# Altium schematic sheet Hub.SchDoc
size Letter; CompanyName: Ploopy Co; Organization: Ploopy Co; Address1: 137-1140 Burnhamthorpe Road W; Address2: Mississauga; Address3: Ontario; Address4: Canada L5C 0A3; DocumentNumber: 1; Revision: R1.001; SheetNumber: 1; SheetTotal: 7
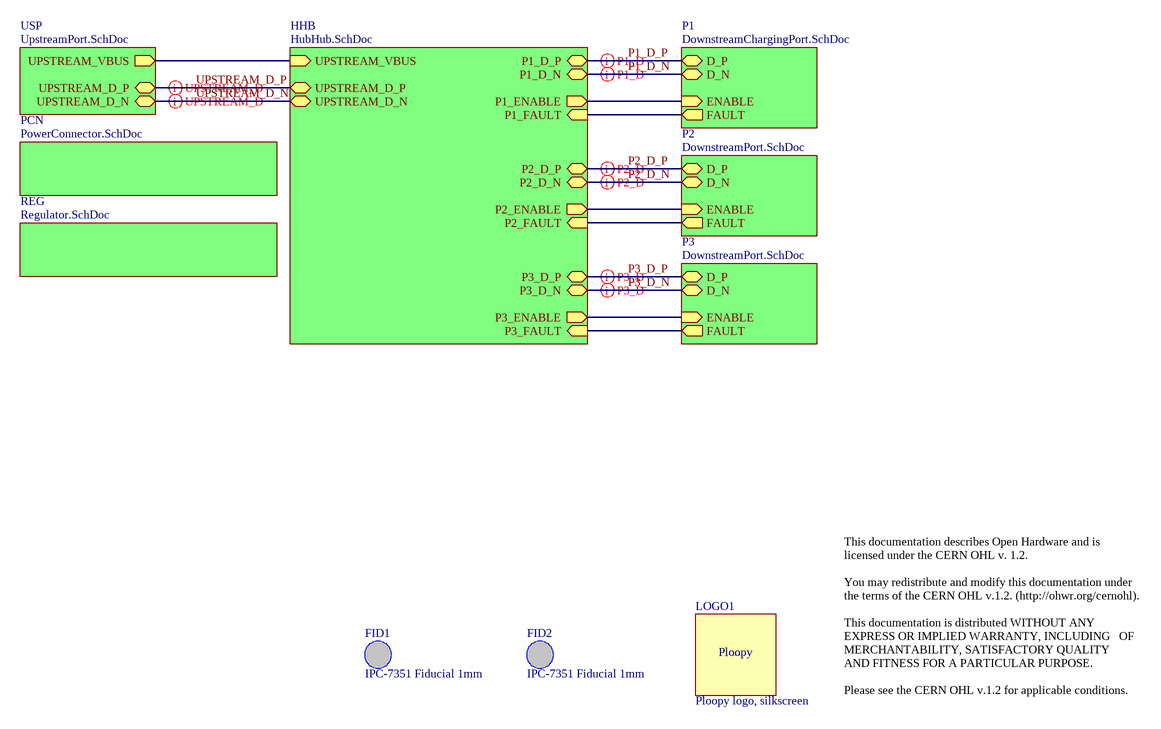
[diagram p0: Hub.SchDoc]

## Parts
FID1  IPC-7351 Fiducial 1mm  [FIDUCIAL_1.5]
FID2  IPC-7351 Fiducial 1mm  [FIDUCIAL_1.5]
LOGO1  Ploopy logo, silkscreen  [PloopyLogo]  (no BOM)

## Sub-sheets
HHB = HubHub.SchDoc: P1_ENABLE (out), P2_FAULT (in), P3_FAULT (in), P1_FAULT (in), UPSTREAM_VBUS (in), P3_ENABLE (out), P2_ENABLE (out), P3_D_P (bidir), UPSTREAM_D_P (bidir), P1_D_N (bidir), UPSTREAM_D_N (bidir), P2_D_P (bidir), P2_D_N (bidir), P1_D_P (bidir), P3_D_N (bidir)
P1 = DownstreamChargingPort.SchDoc: FAULT (out), ENABLE (in), D_N (bidir), D_P (bidir)
P2 = DownstreamPort.SchDoc: ENABLE (in), FAULT (out), D_N (bidir), D_P (bidir)
P3 = DownstreamPort.SchDoc: FAULT (out), ENABLE (in), D_N (bidir), D_P (bidir)
PCN = PowerConnector.SchDoc: no entries
REG = Regulator.SchDoc: no entries
USP = UpstreamPort.SchDoc: UPSTREAM_VBUS (out), UPSTREAM_D_N (bidir), UPSTREAM_D_P (bidir)

## Nets
P1_D_N: sheet P1/D_N, sheet HHB/P1_D_N
P1_D_P: sheet P1/D_P, sheet HHB/P1_D_P
P2_D_N: sheet P2/D_N, sheet HHB/P2_D_N
P2_D_P: sheet P2/D_P, sheet HHB/P2_D_P
P3_D_N: sheet HHB/P3_D_N, sheet P3/D_N
P3_D_P: sheet HHB/P3_D_P, sheet P3/D_P
UPSTREAM_D_N: sheet USP/UPSTREAM_D_N, sheet HHB/UPSTREAM_D_N
UPSTREAM_D_P: sheet USP/UPSTREAM_D_P, sheet HHB/UPSTREAM_D_P
(unnamed): sheet P2/ENABLE, sheet HHB/P2_ENABLE
(unnamed): sheet P2/FAULT, sheet HHB/P2_FAULT
(unnamed): sheet USP/UPSTREAM_VBUS, sheet HHB/UPSTREAM_VBUS
(unnamed): sheet P1/FAULT, sheet HHB/P1_FAULT
(unnamed): sheet P1/ENABLE, sheet HHB/P1_ENABLE
(unnamed): sheet HHB/P3_FAULT, sheet P3/FAULT
(unnamed): sheet HHB/P3_ENABLE, sheet P3/ENABLE

Not connected (* = marked no-connect by the designer): FID1 1; FID2 1

## Layout directives
differential pair: P1_D_N, P1_D_P, P2_D_N, P2_D_P, P3_D_N, P3_D_P, UPSTREAM_D_N, UPSTREAM_D_P

## Notes on the sheet
- This documentation describes Open Hardware and is licensed under the CERN OHL v. 1.2.
  You may redistribute and modify this documentation under the terms of the CERN OHL v.1.2. (http://ohwr.org/cernohl).
  This documentation is distributed WITHOUT ANY EXPRESS OR IMPLIED WARRANTY, INCLUDING   OF MERCHANTABILITY, SATISFACTORY QUALITY   AND FITNESS FOR A PARTICULAR PURPOSE.
  Please see the CERN OHL v.1.2 for applicable conditions.
- Copyright Ploopy Corporation 2020
- Licensed under the CERN OHL v. 1.2
- http://ohwr.org/cernohl
- Title:
- PCB:
- Version:
- Ploopy Corporation
- Mississauga ON L5C 0A3
- 137-1140 Burnhamthorpe Road W
- Date:
- Time:
- Sheet
- of
- Canada
- (in symbol PloopyLogo) Ploopy

## Library data of the parts
FID1 FID2 = FIDUCIAL_1.5: PNP-Nzl: 2; PNP-dx: 0; PNP-X: 4; PNP-A: 1; PNP-Thk: 1.02; PNP-TS: 70; PNP-Type: MARK1; PNP-dy: 0; PNP-Y: 4; PNP-Pt: 0; PNP-W: 0; PNP-Lv: 1; PNP-Level: 1; PNP-Voff: 0; PNP-FeedType: Fiducial; PNP-TapeWidth: 0; PNP-PlacePriority: 0; PNP-TapeIndex: 0; PNP-da: 0
LOGO1 = PloopyLogo: PNP-Nzl: 2; PNP-dx: 0; PNP-X: 1; PNP-TS: 70; PNP-Type: CHI; PNP-FeedType: Tape; PNP-TapeWidth: 8; PNP-dy: 0; PNP-Y: 1; PNP-A: 0; PNP-Pt: 0; PNP-W: 0; PNP-Thk: 1; PNP-Lv: 1; PNP-Level: 1; PNP-Voff: 0; PNP-PlacePriority: 1; PNP-TapeIndex: 1; PNP-da: 0